# Altium schematic sheet Sensors.SchDoc
size A
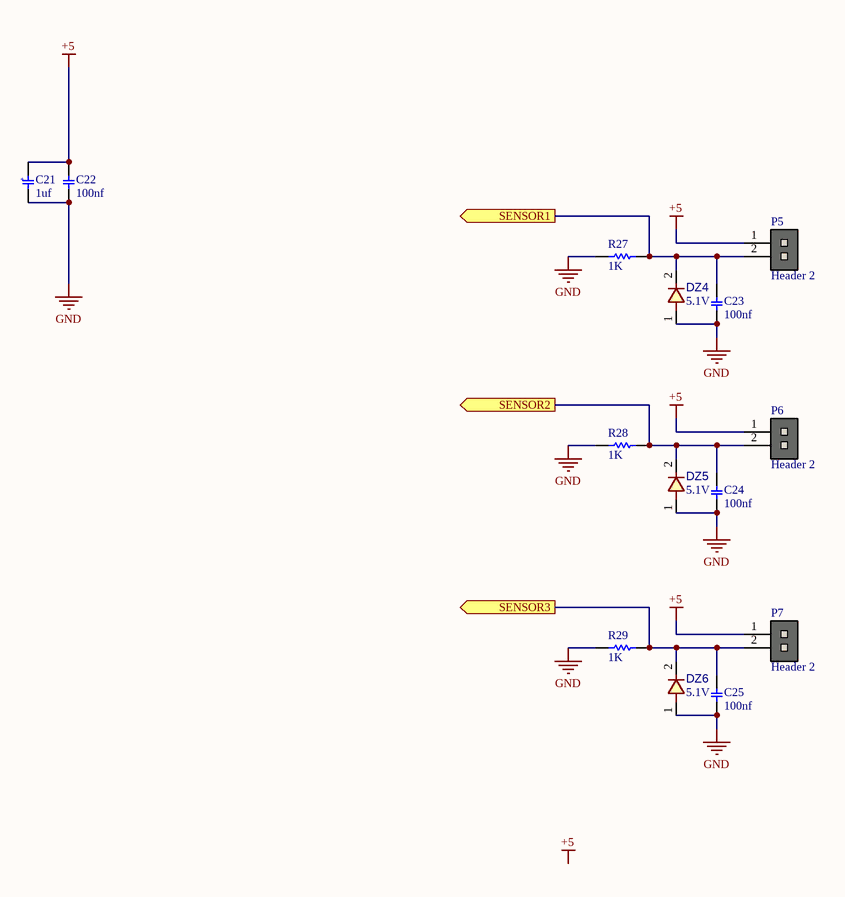
[diagram p0: Sensors.SchDoc]

## Parts
C21  value 1uf  [C_EL_4X7]  (hidden comment: Capacitor Electrical THD)
C22  value 100nf  [C1206]  (hidden comment: Capacitor C SMD 1206)
C23  value 100nf  [C1206]  (hidden comment: Capacitor C SMD 1206)
C24  value 100nf  [C1206]  (hidden comment: Capacitor C SMD 1206)
C25  value 100nf  [C1206]  (hidden comment: Capacitor C SMD 1206)
DZ4  value 5.1V  [D_SOD80]  (hidden comment: 1N4148 SMD)
DZ5  value 5.1V  [D_SOD80]  (hidden comment: 1N4148 SMD)
DZ6  value 5.1V  [D_SOD80]  (hidden comment: 1N4148 SMD)
P5  Header 2  [HDR 1X2]
P6  Header 2  [HDR 1X2]
P7  Header 2  [HDR 1X2]
R27  value 1K  [SMD-1206-RES]  (hidden comment: Resistor SMD 1206)
R28  value 1K  [SMD-1206-RES]  (hidden comment: Resistor SMD 1206)
R29  value 1K  [SMD-1206-RES]  (hidden comment: Resistor SMD 1206)

## Ports
SENSOR1 (out), SENSOR2 (out), SENSOR3 (out)

## Nets
+5: C21.1 C22.2 P5.1 P6.1 P7.1
GND: C21.2 C22.1 C23.1 C24.1 C25.1 DZ4.1 DZ5.1 DZ6.1 R27.1 R28.1 R29.1
SENSOR1: C23.2 DZ4.2 P5.2 R27.2 ; port SENSOR1
SENSOR2: C24.2 DZ5.2 P6.2 R28.2 ; port SENSOR2
SENSOR3: C25.2 DZ6.2 P7.2 R29.2 ; port SENSOR3

## Notes on the sheet
- Labels drawn without touching a wire or pin: +5
- (in symbol Capacitor Electrical THD) +

## Library data of the parts
DZ4-DZ6 = 1N4148 SMD: DIODE, FAST SWTICHING, 0.3A, 0.5W; DatasheetVersion: 2021; ComponentLink1Description: Website Smart World; ComponentLink1URL: https://www.smartw.ir/; ComponentLink2Description: Telegram; ComponentLink2URL: https://t.me/altium_smartw; ComponentLink3Description: Instagram; ComponentLink3URL: https://Instagram.com/smartgw.ir
P5-P7 = Header 2: Header, 2-Pin; ComponentLinkp-URL: https://www.smartw.ir/; DatasheetVersion: 2020
C21 = Capacitor Electrical THD: DatasheetVersion: 2021; ComponentLink1Description: Website Smart World; ComponentLink1URL: https://www.smartw.ir/; ComponentLink2Description: Telegram; ComponentLink2URL: https://t.me/altium_smartw; ComponentLink3Description: Instagram; ComponentLink3URL: https://Instagram.com/smartgw.ir
C22-C25 = Capacitor C SMD 1206: DatasheetVersion: 2021; ComponentLink1Description: Website Smart World; ComponentLink1URL: https://www.smartw.ir/; ComponentLink2Description: Telegram; ComponentLink2URL: https://t.me/altium_smartw; ComponentLink3Description: Instagram; ComponentLink3URL: https://Instagram.com/smartgw.ir
R27-R29 = Resistor SMD 1206: DatasheetVersion: 2021; ComponentLink1Description: Website Smart World; ComponentLink1URL: https://www.smartw.ir/; ComponentLink2Description: Telegram; ComponentLink2URL: https://t.me/altium_smartw; ComponentLink3Description: Instagram; ComponentLink3URL: https://Instagram.com/smartgw.ir